# Altium schematic sheet Connectivity.SchDoc
size A4; SheetNumber: 5; SheetTotal: 6
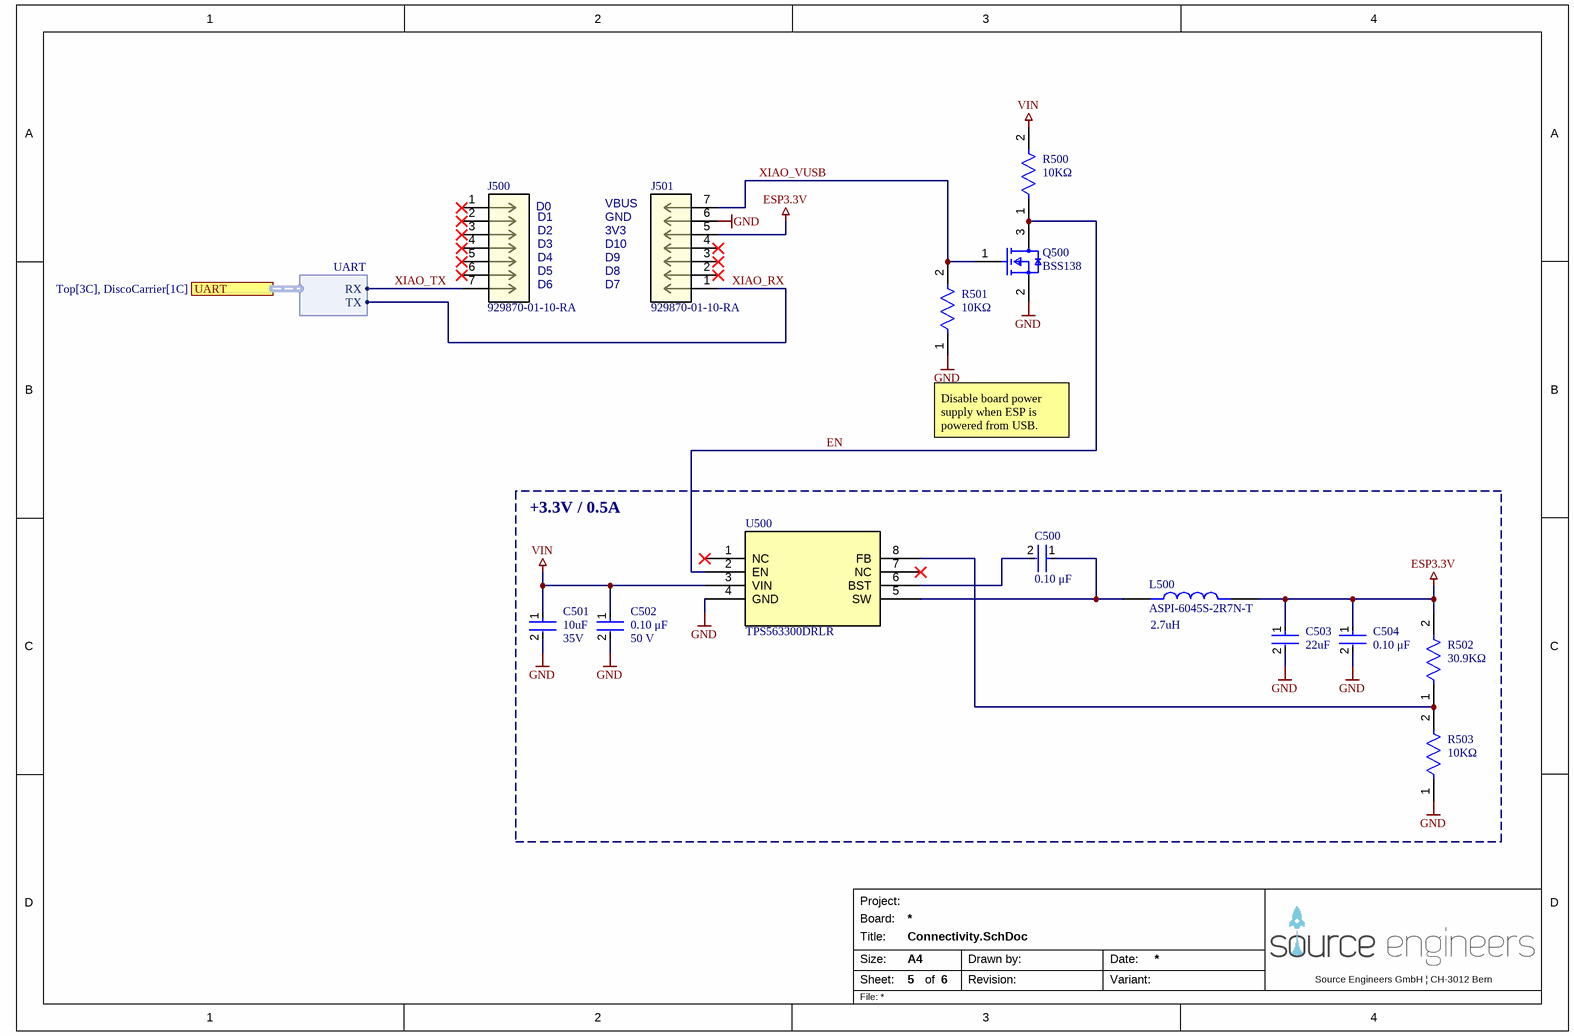
[diagram p0: Connectivity.SchDoc]

## Parts
C500  value 0.10 μF  [FP-C0603C-CF-MFG]  (hidden comment: C0603C104M5RACTU)
C501  Capacitance: 10uF  Voltage Rating: 35V  [FP-GRT31C-0_2-IPC_A]  (hidden comment: GRT31CR6YA106KE01L)
C502  value 0.10 μF  Voltage Rating: 50 V  [FP-C0603C-CF-MFG]  (hidden comment: C0603C104M5RACTU)
C503  Capacitance: 22uF  [FP-GRM319-0_15-IPC_C]  (hidden comment: GRM319R61C226ME15D)
C504  value 0.10 μF  [FP-C0603C-CF-MFG]  (hidden comment: C0603C104M5RACTU)
J500  929870-01-10-RA  [CONN_929870-01-07-RA_3MM]
J501  929870-01-10-RA  [CONN_929870-01-07-RA_3MM]
L500  ASPI-6045S-2R7N-T  value 2.7uH  [IND_ASPI-6045S-2R7N-T]
Q500  BSS138  [FP-318-08-IPC_B]
R500  value 10KΩ  [FP-RT0603-MFG]  (hidden comment: RT0603FRE0710KL)
R501  value 10KΩ  [FP-RT0603-MFG]  (hidden comment: RT0603FRE0710KL)
R502  Resistance: 30.9KΩ  [FP-RT0603-MFG]  (hidden comment: RT0603FRE0730K9L)
R503  value 10KΩ  [FP-RT0603-MFG]  (hidden comment: RT0603FRE0710KL)
U500  TPS563300DRLR  [SOT5X3-8_DRL_TEX]

## Blocks framed on the sheet
+3.3V / 0.5A: C500-C504 L500 R502 R503 U500

## Ports
UART (harness UART, see Top[3C], DiscoCarrier[1C])

## Harnesses
UART: TX, RX

## Nets
ESP3.3V: C503.1 C504.1 J501.5 L500.2 R502.2
GND: C501.2 C502.2 C503.2 C504.2 J501.6 Q500.2(S) R501.1 R503.1 U500.4(GND)
VIN: C501.1 C502.1 R500.2 U500.3(VIN)
EN: Q500.3(D) R500.1 U500.2(EN)
XIAO_RX: J501.1 ; port UART.TX
XIAO_TX: J500.7 ; port UART.RX
XIAO_VUSB: J501.7 Q500.1(G) R501.2
NetC500_1: C500.1 L500.1 U500.5(SW)
NetC500_2: C500.2 U500.6(BST)
NetR502_1: R502.1 R503.2 U500.8(FB)

Not connected (* = marked no-connect by the designer): J500 1* 2* 3* 4* 5* 6*; J501 2* 3* 4*; U500 1(NC)* 7(NC)*

## Notes on the sheet
- (near J500) D0
- (near J500) D1
- (near J500) D2
- (near J500) D3
- D10
- 3V3
- GND
- VBUS
- (near J500) D4
- (near J500) D5
- (near J500) D6
- D7
- D8
- D9
- Disable board power supply when ESP is powered from USB.
- Project:
- Board:
- Title:
- Size:
- Sheet:
- A4
- of
- Drawn by:
- Revision:
- Date:
- Variant:
- Source Engineers GmbH | CH-3012 Bern
- File:

## Library data of the parts
C500 C502 C504 = CMP-2006-03068-2: CAP CER 0.1UF 50V 20% X7R 0603; Manufacturer: KEMET; Material: Ceramic; Tolerance: 0.2; Temperature Coefficient: 30ppm/°C; Automotive Grade: Grade 1; Temperature Range High: +125°C; Device Class L3: Ceramic Capacitors; Manufacturer Part Number: C0603C104M5RACTU; Height: 0.87mm; Category: Cap; RoHS: TRUE; Digikey Description: CAP CER 0.1UF 50V 20% X7R 0603; ComponentLink2URL: https://api.kemet.com/component-edge/download/datasheet/C0603C100J5GACAUTO.pdf; Lead Free: Yes; Temperature Range Low: -55°C; Device Class L1: Passive Components; ComponentLink2Description: Datasheet; Temperature Characteristic: X7R; Automotive: Yes; Temperature: -55°C to +125°C; Octopart: https://octopart.com/c0603c104m5ractu-kemet-11855687; Device Class L2: Capacitors; Package: C0603C-CF; Mouser Description: Multilayer Ceramic Capacitors MLCC - SMD/SMT 50volts 0.1uF X7R 20%; Capacitance: 0.10 μF
  C500 C504: Voltage Rating: 50 V
C501 = CMP-06035-017590-1: Multi-Layer Ceramic Capacitor 10uF 35V X5R ±10% 1206 Emboss T/R; Width: 0.063inch; Tolerance: 10%; Ratings: AEC-Q200; Packaging: Tape and Reel; Min Operating Temperature: -55°C; Case Code (Imperial): 1206; Case/Package: 1206; Max Operating Temperature: 85°C; Thickness: 0.071inch; Case Code (Metric): 3216; Mount: Surface Mount; Length: 0.126inch
C503 = CMP-06035-037955-1: Chip Multilayer Ceramic Capacitors for General Purpose, 1206, 22uF, X5R, 15%, 20%, 16V; Weight: 0.001411oz; Case/Package: 1206; Mount: Surface Mount; Voltage Rating (DC): 16V; Case Code (Metric): 3216; Height: 0.85mm; Package Quantity: 4000; Resistor Type: Ceramic; Thickness: 0.037inch; Packaging: Tape and Reel; Dielectric: X5R; Tolerance: 20%; Case Code (Imperial): 1206; Width: 0.063inch; Termination: SMD/SMT; Voltage Rating: 16V; Length: 0.126inch; Min Operating Temperature: -55°C; Max Operating Temperature: 85°C
J500 J501 = 929870-01-10-RA: No Description Available; Manufacturer_Name: 3M; Copyright: Copyright (C) 2025 Ultra Librarian. All rights reserved.; Manufacturer_Part_Number: 929870-01-10-RA; RefDes: RefDes; Type: Type; Supplier 1: DigiKey; Supplier Part Number 1: 3M157422-ND; Supplier 2: Mouser; Supplier Part Number 2: 517-929870-01-10-RA
Q500 = CMP-07173-000101-1: MOSFET N-CH 50V 220MA SOT-23; Turn-Off Delay Time: 20ns; Element Configuration: Single; Rds On Max: 3.5R; Gate to Source Voltage (Vgs): 20V; Threshold Voltage: 1.3V; Number of Elements: 1; Power Dissipation: 360mW; Rise Time: 9ns; Turn-On Delay Time: 2.5ns; Input Capacitance: 27pF; On-State Resistance: 6R; Lead Free: Lead Free; Length: 2.92mm; Width: 1.3mm; Drain to Source Breakdown Voltage: 50V; Min Operating Temperature: -55°C; REACH SVHC: No SVHC; Packaging: Tape and Reel; Radiation Hardening: No; Height: 0.93mm; Drain to Source Voltage (Vdss): 50V; Current Rating: 220mA; Voltage Rating (DC): 50V; Weight: 0.03g; Continuous Drain Current (ID): 220mA; Number of Pins: 3; Nominal Vgs: 1.3V; Max Power Dissipation: 360mW; Fall Time: 9ns; Drain to Source Resistance: 3.5R; Contact Plating: Tin; Case/Package: SOT-23; Package Quantity: 1; Dual Supply Voltage: 50V; Mount: Surface Mount; Termination: SMD/SMT; Max Operating Temperature: 150°C
R500 R501 R503 = CMP-03412-005349-1: RES SMD 10K OHM 1% 1/10W 0603; Manufacturer: Yageo; Temperature Coefficient: 50 ppm/°C; Power Rating: 0.1W; Tolerance: 0.01; Voltage Rating: 75V; RoHS: TRUE; Category: Res; Automotive: No; Digikey Description: RES SMD 10K OHM 1% 1/10W 0603; ComponentLink2Description: Datasheet; Octopart: https://octopart.com/rt0603fre0710kl-yageo-40009243; ComponentLink2URL: http://www.yageo.com/documents/recent/PYu-RT_1-to-0.01_RoHS_L_9.pdf; Device Class L3: Chip SMD Resistors; Device Class L1: Passive Components; Temperature Range High: +155°C; Height: 0.55mm; Composition: Thin Film; Ipc Land Pattern Name: RESC16080X45; Series: RT; Package: RT0603; Resistance: 10KΩ; Footprint Url: http://www.yageo.com/exep/pages/download/literatures/PYu-R_Mount_10.pdf; Temperature: -55°C to +155°C; Temperature Range Low: -55°C; Lead Free: Yes; Device Class L2: Resistors; Mouser Description: Thin Film Resistors - SMD 10K ohm 1% 1/10W; Manufacturer Part Number: RT0603FRE0710KL
R502 = CMP-03412-002652-1: RES SMD 30.9K OHM 1% 1/10W 0603; Manufacturer: Yageo; Value: 30.9KΩ; Voltage Rating: 75V; Temperature Coefficient: 50 ppm/°C; Power Rating: 0.1W; Tolerance: 0.01; Temperature Range High: +155°C; Category: Res; Octopart: https://octopart.com/rt0603fre0730k9l-yageo-1413622; Series: RT; Device Class L3: Chip SMD Resistors; Mouser Description: Thin Film Resistors - SMD 1/10W 30.9K ohm 1% 50ppm; Height: 0.55mm; Ipc Land Pattern Name: RESC16080X45; Device Class L1: Passive Components; ComponentLink2Description: Datasheet; Device Class L2: Resistors; Temperature Range Low: -55°C; Lead Free: Yes; Temperature: -55°C to +155°C; RoHS: TRUE; Manufacturer Part Number: RT0603FRE0730K9L; Digikey Description: RES SMD 30.9K OHM 1% 1/10W 0603; Composition: Thin Film; Package: RT0603; ComponentLink2URL: http://www.yageo.com/documents/recent/PYu-RT_1-to-0.01_RoHS_L_9.pdf; Automotive: No; Footprint Url: http://www.yageo.com/exep/pages/download/literatures/PYu-R_Mount_10.pdf
U500 = TPS563300DRLR: 3.8-V to 28-V Input, 3-A synchronous buck converter in SOT-583 package 8-SOT-5X3 -40 to 150; Manufacturer_Name: Texas Instruments; Copyright: Copyright (C) 2025 Ultra Librarian. All rights reserved.; Manufacturer_Part_Number: TPS563300DRLR; RefDes: RefDes; Type: Type; Supplier 1: DigiKey; Supplier Part Number 1: 296-TPS563300DRLRCT-ND; Supplier 2: DigiKey; Supplier Part Number 2: 296-TPS563300DRLRDKR-ND; Supplier 3: Mouser; Supplier Part Number 3: 595-TPS563300DRLR
L500 = ASPI-6045S-2R7N-T: Package: None; Price: None; MP: ASPI-6045S-2R7N-T; Availability: Unavailable; Supplier 1: DigiKey; Supplier Part Number 1: ASPI-6045S-2R7N-TCT-ND; Supplier 2: DigiKey; Supplier Part Number 2: ASPI-6045S-2R7N-TDKR-ND; Supplier 3: DigiKey; Supplier Part Number 3: ASPI-6045S-2R7N-TTR-ND; Supplier 4: Mouser; Supplier Part Number 4: 815-ASPI-6045S-2R7NT